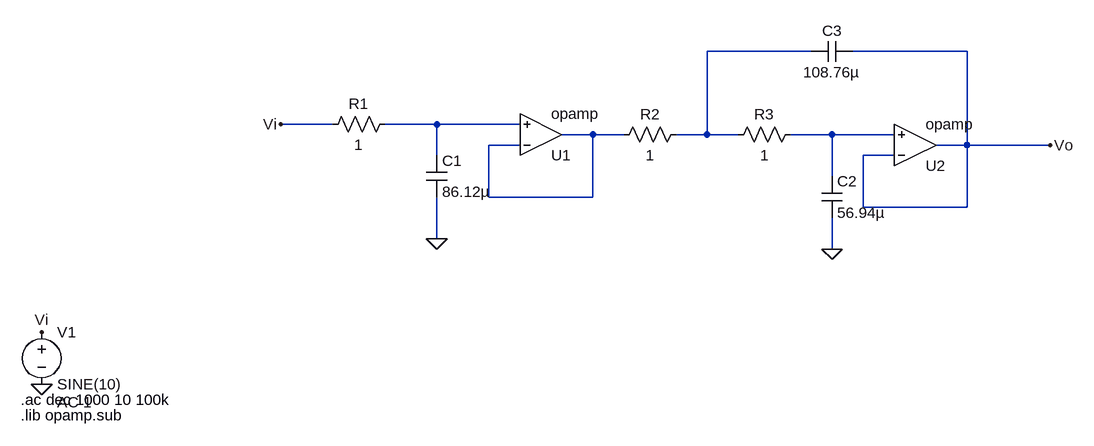
[diagram p0: schematic filtro_pasabajos_bessel.asc]
filtro_pasabajos_bessel.asc, the LTspice schematic file:
Version 4.1
SHEET 1 1200 680
WIRE 784 0 624 0
WIRE 1024 0 848 0
WIRE 48 112 -32 112
WIRE 208 112 128 112
WIRE 336 112 208 112
WIRE 448 128 400 128
WIRE 496 128 448 128
WIRE 624 128 624 0
WIRE 624 128 576 128
WIRE 672 128 624 128
WIRE 816 128 752 128
WIRE 912 128 816 128
WIRE 336 144 288 144
WIRE 1024 144 1024 0
WIRE 1024 144 976 144
WIRE 1152 144 1024 144
WIRE 208 160 208 112
WIRE 912 160 864 160
WIRE 816 192 816 128
WIRE 288 224 288 144
WIRE 448 224 448 128
WIRE 448 224 288 224
WIRE 864 240 864 160
WIRE 1024 240 1024 144
WIRE 1024 240 864 240
WIRE 208 288 208 224
WIRE 816 304 816 256
FLAG -32 112 Vi
FLAG 208 288 0
FLAG 816 304 0
FLAG 1152 144 Vo
FLAG -400 512 0
FLAG -400 432 Vi
SYMBOL res 144 96 R90
WINDOW 0 0 56 VBottom 2
WINDOW 3 32 56 VTop 2
SYMATTR InstName R1
SYMATTR Value 1
SYMBOL cap 192 160 R0
SYMATTR InstName C1
SYMATTR Value 86.12µ
SYMBOL OpAmps\\opamp 368 192 M180
SYMATTR InstName U1
SYMBOL res 592 112 R90
WINDOW 0 0 56 VBottom 2
WINDOW 3 32 56 VTop 2
SYMATTR InstName R2
SYMATTR Value 1
SYMBOL res 768 112 R90
WINDOW 0 0 56 VBottom 2
WINDOW 3 32 56 VTop 2
SYMATTR InstName R3
SYMATTR Value 1
SYMBOL OpAmps\\opamp 944 208 M180
SYMATTR InstName U2
SYMBOL cap 800 192 R0
SYMATTR InstName C2
SYMATTR Value 56.94µ
SYMBOL cap 848 -16 R90
WINDOW 0 0 32 VBottom 2
WINDOW 3 32 32 VTop 2
SYMATTR InstName C3
SYMATTR Value 108.76µ
SYMBOL voltage -400 416 R0
WINDOW 123 24 124 Left 2
WINDOW 39 0 0 Left 0
SYMATTR InstName V1
SYMATTR Value SINE(10)
SYMATTR Value2 AC 1
TEXT -432 536 Left 2 !.ac dec 1000 10 100k
TEXT -432 560 Left 2 !.lib opamp.sub

The netlist it stands for:
* filtro_pasabajos_bessel.asc
R1 N002 Vi 1
C1 N002 0 86.12µ
X§U1 N003 N002 N003 opamp Aol=100K GBW=10Meg  ; pins invin noninvin out
R2 N001 N003 1
R3 N004 N001 1
X§U2 Vo N004 Vo opamp Aol=100K GBW=10Meg  ; pins invin noninvin out
C2 N004 0 56.94µ
C3 Vo N001 108.76µ
V1 Vi 0 SINE(10) AC 1
.ac dec 1000 10 100k
.lib opamp.sub
.backanno
.end